# EAGLE design wm8731_breakout (EAGLE 6.2)
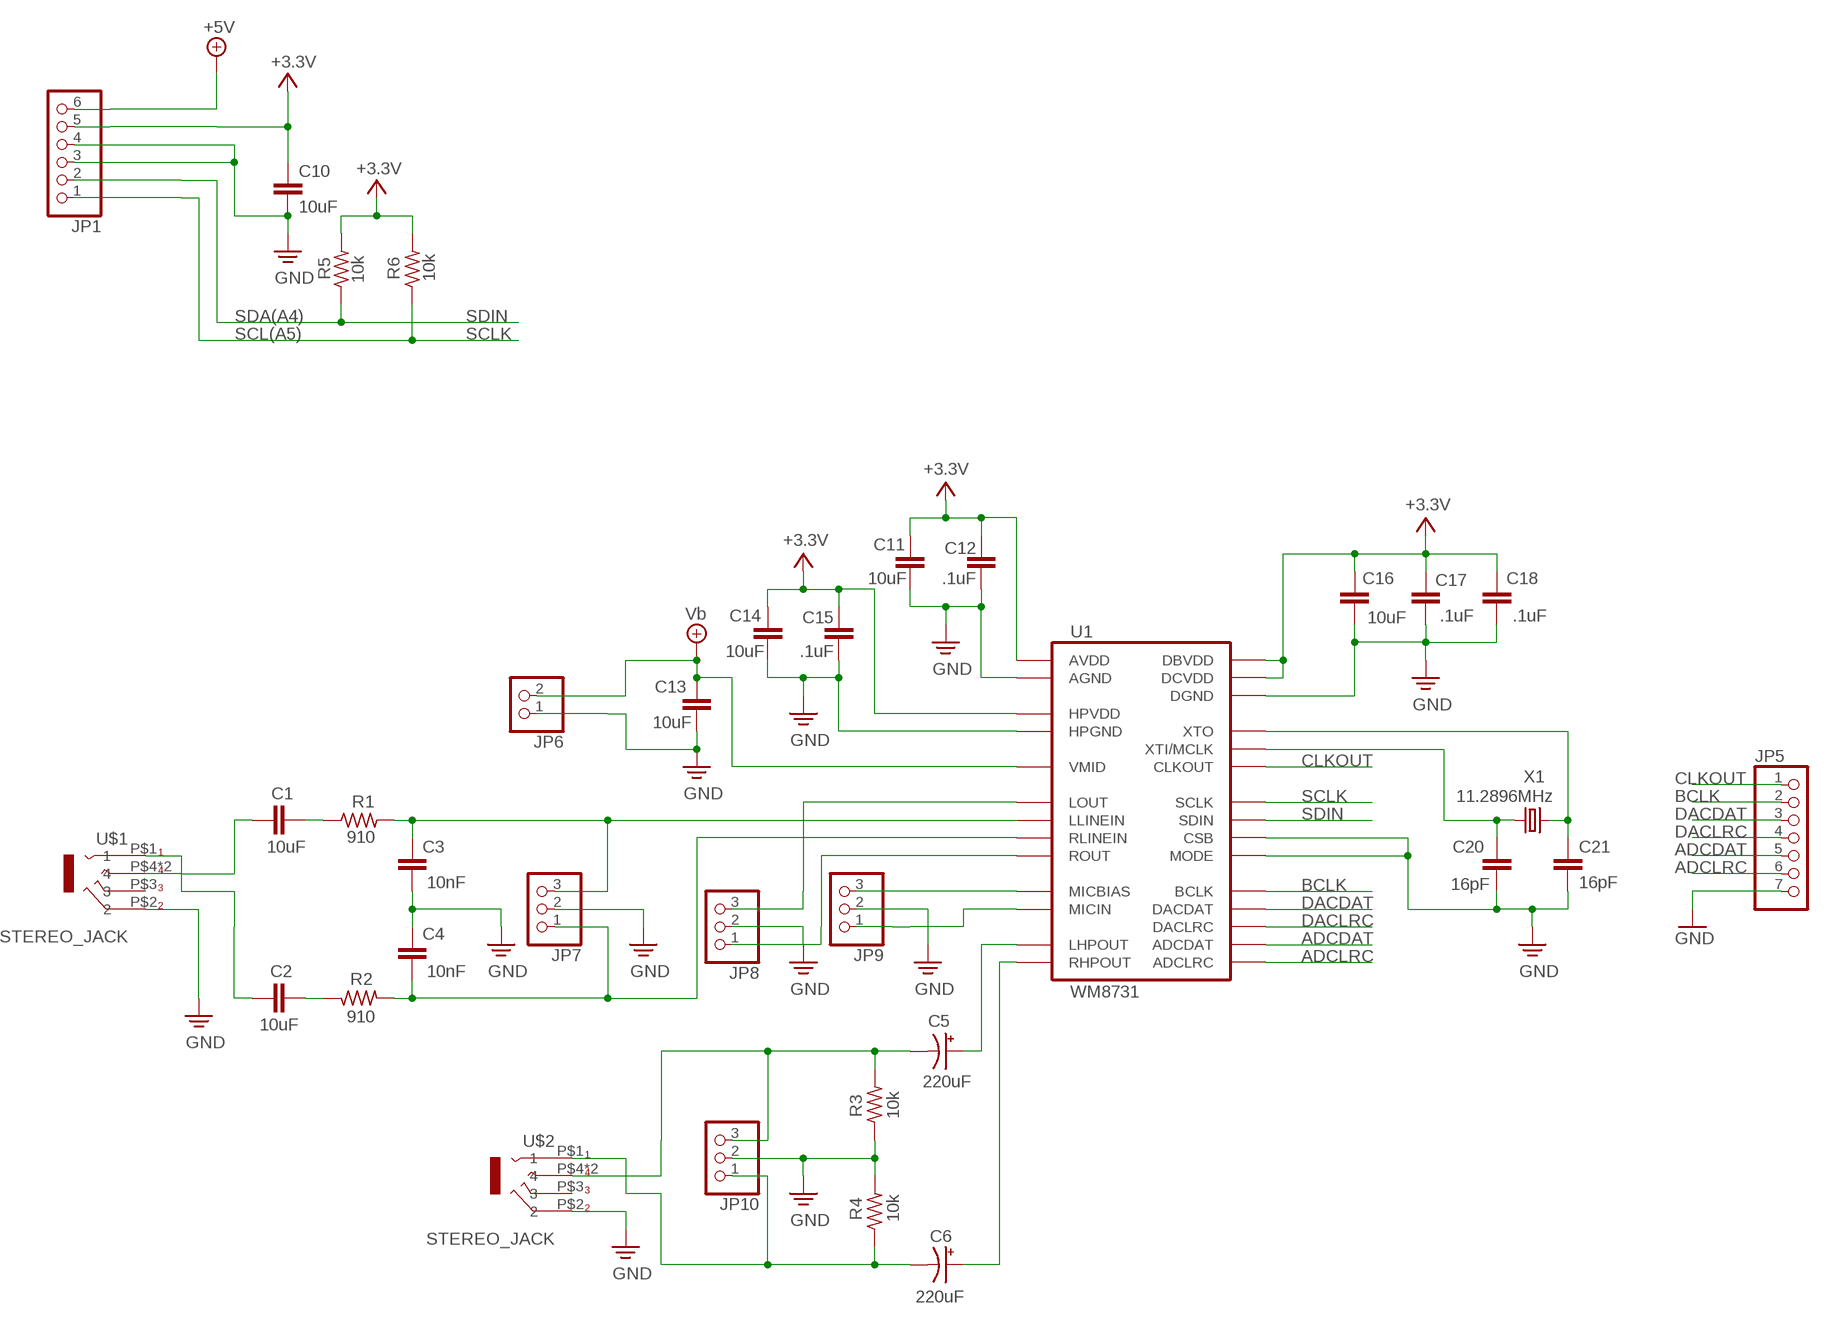
[diagram p0: schematic, sheet 1]

## Parts
C1  10uF  CAPACITOR0805  [0805A]
C2  10uF  CAPACITOR0805  [0805A]
C3  10nF  CAPACITOR0805  [0805A]
C4  10nF  CAPACITOR0805  [0805A]
C5  220uF  CAPACITOR-POL6.3MMX2.5MM  [CAP/6.3MMX2.5MM]
C6  220uF  CAPACITOR-POL6.3MMX2.5MM  [CAP/6.3MMX2.5MM]
C10  10uF  CAPACITOR0805  [0805A]
C11  10uF  CAPACITOR0805  [0805A]
C12  .1uF  CAPACITOR0805  [0805A]
C13  10uF  CAPACITOR0805  [0805A]
C14  10uF  CAPACITOR0805  [0805A]
C15  .1uF  CAPACITOR0805  [0805A]
C16  10uF  CAPACITOR0805  [0805A]
C17  .1uF  CAPACITOR0805  [0805A]
C18  .1uF  CAPACITOR0805  [0805A]
C20  16pF  CAPACITOR0805  [0805A]
C21  16pF  CAPACITOR0805  [0805A]
JP1  PINHD-1X6  [1X06]
JP5  PINHD-1X7  [1X07]
JP6  PINHD-1X2  [1X02]
JP7  PINHD-1X3  [1X03]
JP8  PINHD-1X3  [1X03]
JP9  PINHD-1X3  [1X03]
JP10  PINHD-1X3  [1X03]
R1  910  RESISTOR0805  [0805A]
R2  910  RESISTOR0805  [0805A]
R3  10k  RESISTOR0805  [0805A]
R4  10k  RESISTOR0805  [0805A]
R5  10k  RESISTOR0805  [0805A]
R6  10k  RESISTOR0805  [0805A]
U1  WM8731  [28-SSOP]
U$1  STEREO_JACK  [JACK_STEREO]
U$2  STEREO_JACK  [JACK_STEREO]
X1  11.2896MHz  CRYSTALHC49U/SMT  [HC49U/SMT]

## Nets
+5V: JP1.6
+5V/1: C13.- JP6.2 U1.P$16(VMID) ; supply symbol labelled Vb
ADCDAT: JP5.5 U1.P$6(ADCDAT)
ADCLRC: JP5.6 U1.P$7(ADCLRC)
BCLK: JP5.2 U1.P$3(BCLK)
CLKOUT: JP5.1 U1.P$2(CLKOUT)
DACDAT: JP5.3 U1.P$4(DACDAT)
DACLRC: JP5.4 U1.P$5(DACLRC)
GND: JP5.7
LINE_IN: C1.+ U$1.P$4 U$1.P$5
N$1: C5.P$1(+) U1.P$9(LHPOUT)
N$2: C6.P$1(+) U1.P$10(RHPOUT)
N$3: JP9.1 U1.P$18(MICIN)
N$4: C1.- R1.+
N$5: C5.P$2(-) JP10.3 R3.- U$2.P$4 U$2.P$5
N$6: C6.P$2(-) JP10.1 R4.+ U$2.P$1
N$7: JP8.3 U1.P$12(LOUT)
N$9: JP8.1 U1.P$13(ROUT)
N$10: C3.- JP7.3 R1.- U1.P$20(LLINEIN)
N$16: C2.- U$1.P$1
N$17: C2.+ R2.+
N$23: C4.- JP7.1 R2.- U1.P$19(RLINEIN)
N$35: JP9.3 U1.P$17(MICBIAS)
N$57: C20.+ U1.P$25(XTI/MCLK) X1.1
N$58: C21.+ U1.P$26(XTO) X1.2
PE: C3.+ C4.+ C10.- C11.+ C12.+ C13.+ C14.+ C15.+ C16.+ C17.+ C18.+ C20.- C21.- JP1.3 JP1.4 JP6.1 JP7.2 JP8.2 JP9.2 JP10.2 R3.+ R4.- U1.P$11(HPGND) U1.P$15(AGND) U1.P$21(MODE) U1.P$22(CSB) U1.P$28(DGND) U$1.P$2 U$2.P$2 ; supply symbol labelled GND
SCLK: JP1.1 R6.+ U1.P$24(SCLK)
SDIN: JP1.2 R5.+ U1.P$23(SDIN)
VCC: C10.+ C11.- C12.- C14.- C15.- C16.- C17.- C18.- JP1.5 R5.- R6.- U1.P$1(DBVDD) U1.P$8(HPVDD) U1.P$14(AVDD) U1.P$27(DCVDD) ; supply symbol labelled +3.3V
Unconnected: U$1.P$3 U$2.P$3

## Notes on the sheet
- SDA(A4)
- SCL(A5)

## Library data of the parts
C1-C4 C10-C18 C20 C21 = audioint:CAPACITOR
C5 C6 = audioint:CAPACITOR-POL
JP1 = pinhead:PINHD-1X6: PIN HEADER
JP5 = pinhead:PINHD-1X7: PIN HEADER
JP6 = pinhead:PINHD-1X2: PIN HEADER
JP7-JP10 = pinhead:PINHD-1X3: PIN HEADER
R1-R6 = audioint:RESISTOR
U1 = audioint:WM8731
U$1 U$2 = stero jack:STEREO_JACK
X1 = audioint:CRYSTAL

## Net classes
0 default: width 0.203 mm

## Board
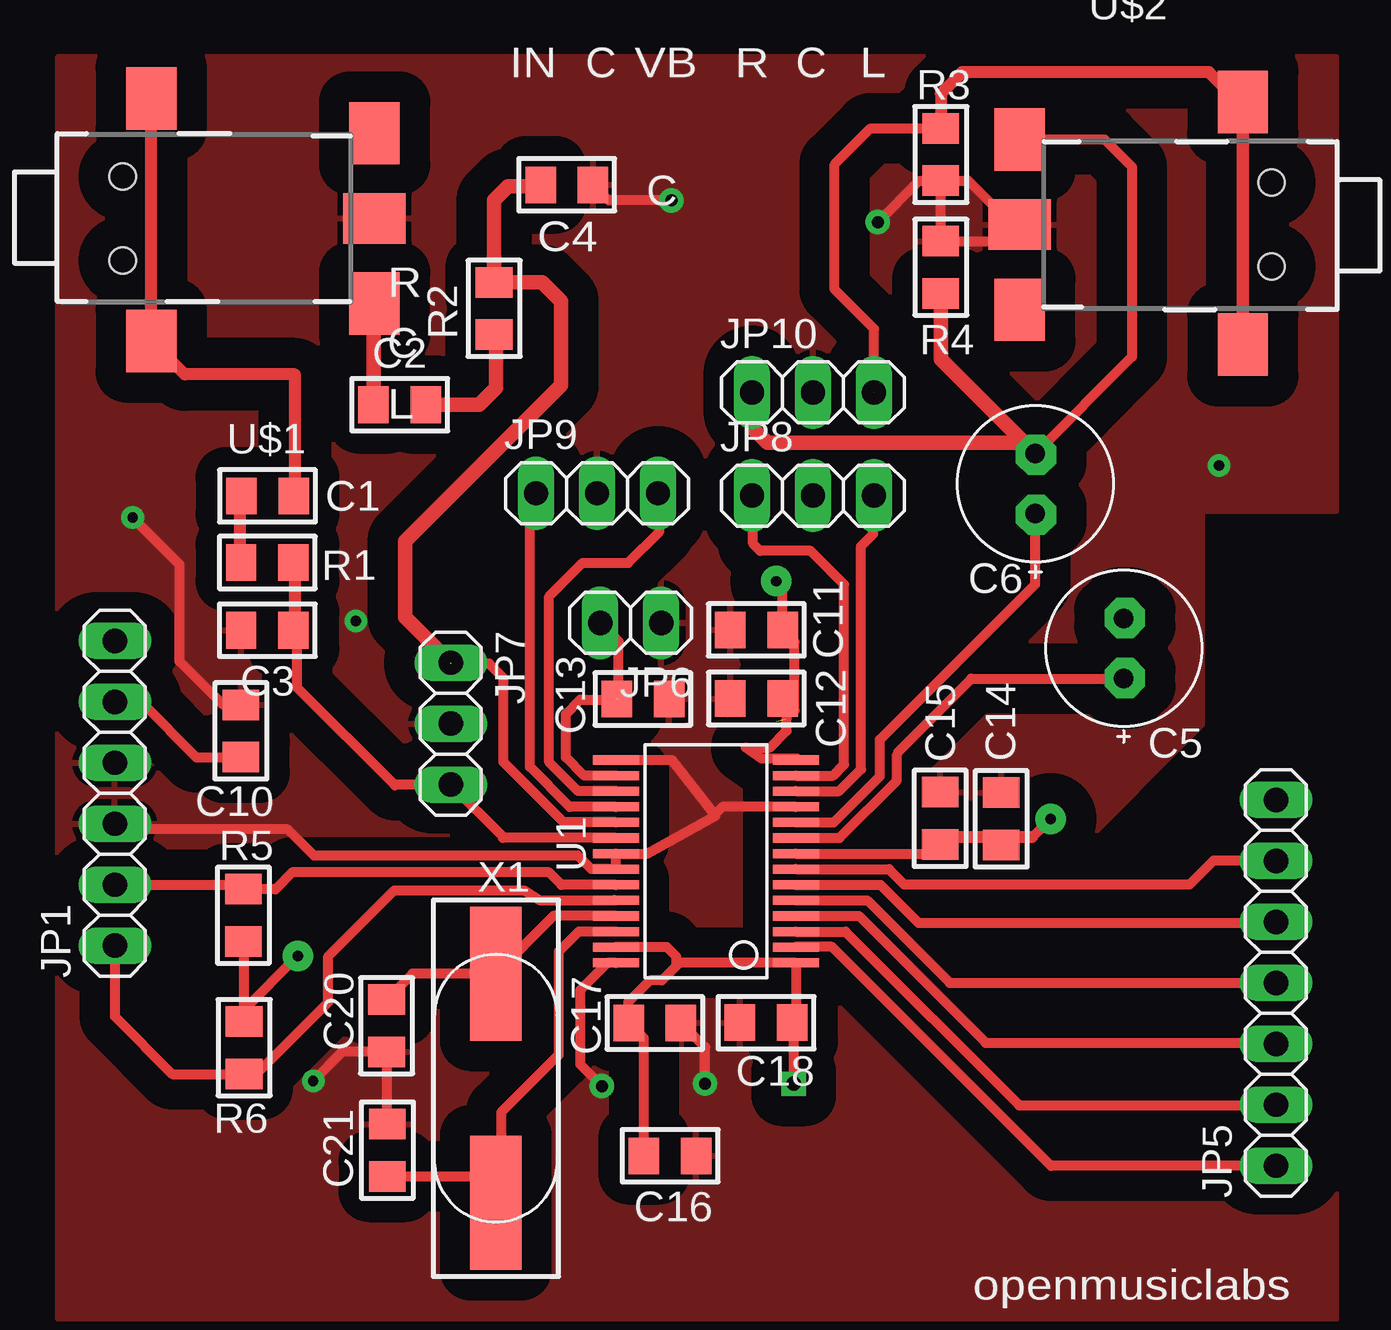
[diagram p1: board, top side]
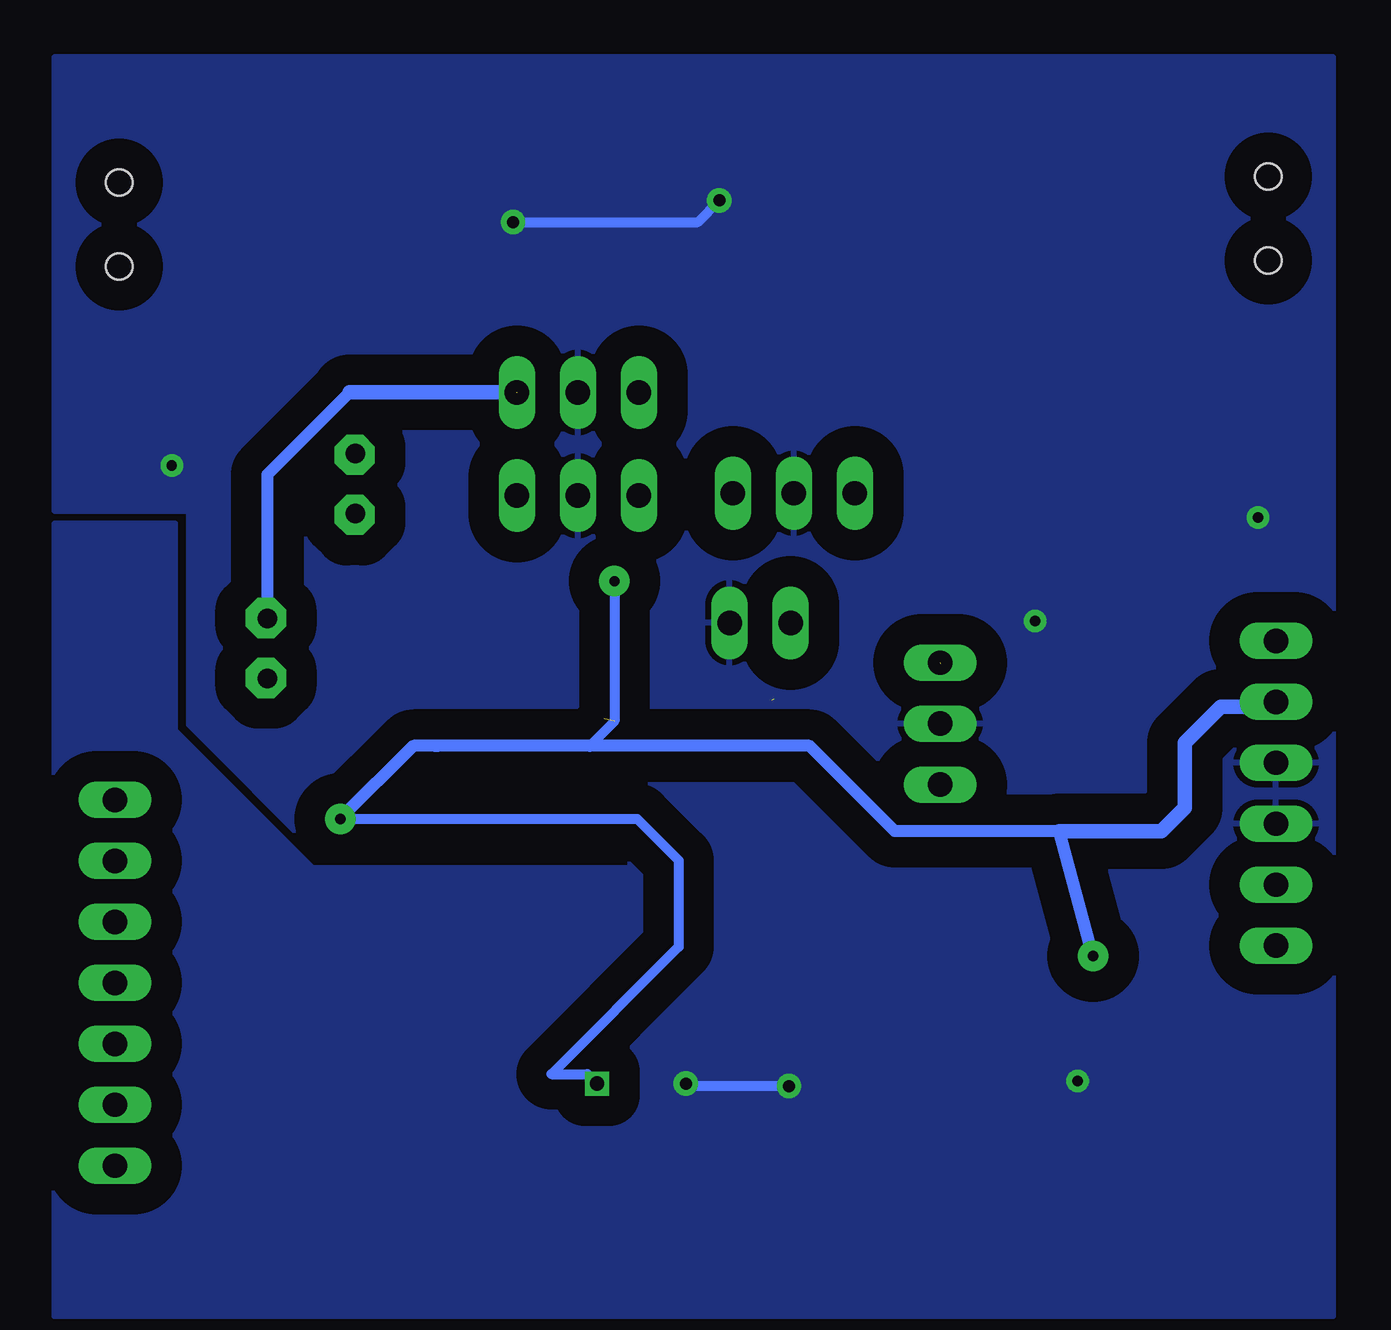
[diagram p2: board, bottom side, seen from below]

No outline drawn. Coordinates in mm, seen from the top.
Copper layers (1*16): Top 0.035mm / dielectric 1.5mm / Bottom 0.035mm
Design rules: minimum track width 8mil, minimum drill 15mil, track to track 8mil, track to pad 8mil, pad to pad 8mil, via to via 8mil, smd to smd 8mil, copper to edge 8mil, drill to drill 8mil, minimum pad ring 10mil, minimum via ring 8mil, stop-mask expansion 4mil, vias tented up to drill 0mil, thermal gap 10mil

### Footprints (pad centres in the part's own frame; a part is rotated, then mirrored left to right if it is on the bottom)
0805A = smd 1.27 x 1.524: + 1.091,0; - -1.091,0
CAP/6.3MMX2.5MM = drill 0.813 pad 1.321: P$1 1.25,0; P$2 -1.25,0
1X06 = drill 1.016 long: 1 -6.35,0; 2 -3.81,0; 3 -1.27,0; 4 1.27,0; 5 3.81,0; 6 6.35,0
1X07 = drill 1.016 long: 1 -7.62,0; 2 -5.08,0; 3 -2.54,0; 4 0,0; 5 2.54,0; 6 5.08,0; 7 7.62,0
1X02 = drill 1.016 long: 1 -1.27,0; 2 1.27,0
1X03 = drill 1.016 long: 1 -2.54,0; 2 0,0; 3 2.54,0
28-SSOP = smd 0.381 x 1.905: P$1 -4.55,-3.752; P$2 -3.9,-3.752; P$3 -3.25,-3.752; P$4 -2.6,-3.752; P$5 -1.95,-3.752; P$6 -1.3,-3.752; P$7 -0.65,-3.752; P$8 0,-3.752; P$9 0.65,-3.752; P$10 1.3,-3.752; P$11 1.95,-3.752; P$12 2.6,-3.752; P$13 3.25,-3.752; P$14 3.9,-3.752; P$15 3.9,3.752; P$16 3.25,3.752; P$17 2.6,3.752; P$18 1.95,3.752; P$19 1.3,3.752; P$20 0.65,3.752; P$21 0,3.752; P$22 -0.65,3.752; P$23 -1.3,3.752; P$24 -1.95,3.752; P$25 -2.6,3.752; P$26 -3.25,3.752; P$27 -3.9,3.752; P$28 -4.55,3.752
JACK_STEREO = smd 2.6 x 2.1: P$1 -3.55,-7; P$3 3.55,-7; P$4 -5.1,2.3; P$5 5,2.3 | smd 2.1 x 2.6: P$2 0,-7 | hole 1.1: -1.75,3.5; 1.75,3.5
HC49U/SMT = smd 5.588 x 2.134: 1 -4.774,0; 2 4.774,0

### Placement (x,y rotation side)
C1  8.96,34.39 0 top
C2  14.48,38.19 0 top
C3  8.96,28.79 180 top
C4  21.44,47.35 0 top
C5  44.65,28.04 270 top
C6  40.97,34.9 270 top
C10  7.86,24.6 270 top
C11  29.34,28.81 180 top
C12  29.34,25.95 180 top
C13  24.61,25.93 0 top
C14  39.54,20.93 90 top
C15  37,20.96 90 top
C16  25.74,6.89 0 top
C17  25.11,12.43 0 top
C18  29.75,12.44 180 top
C20  13.93,12.31 90 top
C21  13.96,7.13 270 top
JP1  2.6,22 90 top
JP5  51,14.1 90 top
JP6  24.1,29.1 180 top
JP7  16.6,24.9 270 top
JP8  31.7,34.4 0 top
JP9  22.7,34.5 0 top
JP10  31.7,38.7 0 top
R1  8.96,31.61 180 top
R2  18.41,42.2 270 top
R3  37.03,48.62 270 top
R4  37.03,43.92 270 top
R5  7.96,16.92 90 top
R6  7.99,11.4 270 top
U1  27.24,19.49 90 top
U$1  6.42,45.95 90 top
U$2  47.32,45.7 270 top
X1  18.48,9.71 270 top

### Tracks (layer width: path | path; a pad name or v marks a point on that pad's centre or on a via)
+5V/1  (1 unrouted)
  Top 0.254: C13.- 23.49,25.93
  Top 0.406: U1.P$16 22.16,22.74 21.4,23.5 21.4,25.3 22,25.9 23.6,25.9 23.6,28.26 23.6,28.33 JP6.2
ADCDAT
  Top 0.406: U1.P$6 34.51,18.19 36.1,16.6 50.96,16.6 JP5.5
ADCLRC
  Top 0.254: 30.93,18.9 U1.P$7
  Top 0.406: U1.P$7 34.88,18.84 34.88,18.82 35.5,18.2 47.4,18.2 48.4,19.2 50.98,19.2 JP5.6
BCLK
  Top 0.406: U1.P$3 33.06,16.24 40.3,9 50.98,9 JP5.2
CLKOUT
  Top 0.406: JP5.1 41.62,6.48 32.5,15.6 31,15.6 U1.P$2
DACDAT
  Top 0.406: U1.P$4 33.61,16.89 38.9,11.6 50.96,11.6 JP5.3
DACLRC
  Top 0.406: U1.P$5 33.96,17.54 37.4,14.1 JP5.4
LINE_IN
  Top 0.508: 10.11,34.34 10.11,34.27 | C1.+ 10.11,34.34 | 10.11,34.34 10.11,39.45 5.52,39.45 U$1.P$4 U$1.P$5
N$1
  Top 0.406: U1.P$9 32.81,20.14 35.2,22.52 35.2,23.57 35.25,23.72 38.3,26.77 44.65,26.77
  Top 0.508: 44.65,26.77 C5.P$1
N$2
  Top 0.406: U1.P$10 32.57,20.79 34.49,22.71 34.49,24.23 35,24.74 | 35,24.74 34.74,24.49 | 35,24.74 40.97,30.71 C6.P$1
N$3
  Top 0.406: U1.P$18 21.56,21.44 19.9,23.1 19.9,34.03 19.9,34.24 JP9.1
N$4
  Top 0.508: 7.82,31.57 7.82,31.47 | R1.+ 7.82,31.57 | C1.- 7.82,34.34 7.82,31.57
N$5  (1 unrouted)
  Top 0.406: JP10.3 34.25,41.35 32.6,43 32.6,48.2 34.1,49.7 R3.-
  Top 0.508: U$2.P$4 U$2.P$5 49.62,50.63 48.21,52.05 37.92,52.05 37.03,51.16 R3.-
  Bottom 0.508: C5.P$2 44.65,35.28 41.22,38.71
  Bottom 0.61: JP10.3 41.21,38.7 41.22,38.71
N$6
  Top 0.406: U$2.P$1 43.85,49.24 45,48.1 45,40.18 C6.P$2
  Top 0.61: R4.+ 37.03,40.09 C6.P$2 40.52,36.6 29.8,36.6 29.16,37.24 JP10.1
  Bottom 0.508: C6.P$2 40.97,36.17
N$7
  Top 0.406: U1.P$12 32.79,22.09 33.7,23 33.7,32.3 34.2,32.8 34.2,34.36 JP8.3
N$9
  Top 0.406: U1.P$13 32.54,22.74 33,23.2 33,30.7 31.6,32.1 29.5,32.1 29.2,32.4 29.2,34.36 JP8.1
N$10
  Top 0.406: U1.P$20 18.77,20.14 18.77,20.19 JP7.3 14.31,22.36 14.27,22.33 10.2,26.4 10.2,28.64 C3.-
  Top 0.508: 10.11,28.73 10.11,28.68 | C3.- 10.11,28.73 | R1.- 10.11,31.55 10.11,28.73
N$12  (via drill 0.5 pad 1.68)
  other vias: 41,33.6
N$13  (via drill 0.5 pad 1.68)
  other vias: 41,36.1
N$16
  Top 0.61: C2.- 13.38,42.36 U$1.P$1
N$17
  Top 0.61: C2.+ 17.79,38.19 18.5,38.9 18.5,41.02 R2.+
N$18  (via drill 0.5 pad 1.68)
  other vias: 44.7,29.3
N$21  (via drill 0.5 pad 1.68)
  other vias: 44.7,26.8
N$23  (1 unrouted)
  Top 0.406: U1.P$19 21.31,20.79 18.8,23.3 18.8,26.8 18.2,27.4 16.59,27.4 | JP7.1 16.55,27.44 14.68,29.31
  Top 0.61: C4.- 20.29,47.3 19,47.3 18.41,46.71 R2.- 20.41,43.29 21.2,42.5 21.2,39 14.7,32.5 14.7,29.34 JP7.1
N$35
  Top 0.406: U1.P$17 21.91,22.09 20.7,23.3 20.7,30.2 22.1,31.6 24,31.6 25.3,32.9 25.3,34.35 25.3,34.44 JP9.3
N$57
  Top 0.406: U1.P$25 20.89,16.89 X1.1 15.01,14.49 C20.+
N$58
  Top 0.254: 18.23,4.93 18.24,4.94 X1.2 18.73,4.94 | 18.73,4.94 18.74,4.93 | 17.63,6.04 17.84,5.83 18.73,4.94
  Top 0.406: U1.P$26 21.94,16.24 21.1,15.4 21.1,11.1 18.7,8.7 18.7,6.7 17.84,5.83 | C21.+ 17.63,6.04
PE  (via drill 0.43 pad 0.94, 0.5 pad 1.02)
  Top 0.406: U1.P$15 25.81,23.39 27.6,21.1 | 27.6,21.1 27.63,21.06 24.79,19.49 U1.P$21 U1.P$22 22.46,18.84 21.9,19.4 15.5,19.4 10.9,19.4 9.8,20.5 2.83,20.5 JP1.3 | U1.P$11 27.94,21.44 27.6,21.1 | v10.87,10.01 12.08,11.22 C20.- 13.93,8.25 C21.- | U1.P$28 23.14,14.94 22,13.8 22,10.7 v22.9,9.8 | v27.2,9.9 27.2,11.43 C17.+ | R3.+ 38.17,47.52 39.6,46.1 39.91,46.1 U$2.P$2 39.63,45.01 R4.- 37.03,47.23 37.3,47.5 36.1,47.5 v34.4,45.8 | v25.8,46.7 23.18,46.7 C4.+ | C10.- 7.87,25.7 7.1,25.7 5.3,27.5 5.3,31.53 v3.35,33.48
  Bottom 0.406: v22.9,9.8 27.1,9.8 v27.2,9.9 | v34.4,45.8 26.7,45.8 v25.8,46.7
  other vias: 48.63,35.65 12.65,29.18
  pour Top (isolate 1.27): 47.95,33.76 53.54,33.76 53.54,52.68 0.2,52.68 0.2,0.1 53.54,0.1 53.54,33.25 48.46,33.25 48.46,24.61 42.74,18.9 29.54,18.9 29.54,19.41 42.49,19.41 47.95,24.87
  pour Bottom (isolate 1.27): 0.2,52.68 53.54,52.68 53.54,33.76 47.95,33.76 47.95,24.87 42.49,19.41 29.54,19.41 29.54,18.9 42.74,18.9 48.46,24.61 48.46,33.25 53.54,33.25 53.54,0.2 0.2,0.2
SCLK
  Top 0.406: U1.P$24 23.42,17.55 20.3,17.55 19.65,17.95 14.25,17.95 11.5,15.2 11.5,13.3 8.51,10.31 R6.+ 5,10.3 2.6,12.7 JP1.1
SDIN
  Top 0.406: U1.P$23 21.21,18.19 20.7,18.7 10,18.7 9.3,18 R5.+ 7.78,18.19 JP1.2
VCC  (via drill 0.43 pad 1.27, 0.6)  (1 unrouted)
  Top 0.254: C15.- 37,19.69 37.03,19.66 36.86,19.49 | 23.31,15.6 23.48,15.6 U1.P$27 | C18.- 30.93,12.54 30.93,12.55 | 30.93,14.88 U1.P$1 | 24.08,12.29 23.82,12.29 | 31.03,23.44 30.95,23.34 U1.P$14 | C12.- 30.93,25.45
  Top 0.406: 31.03,23.44 29.56,23.44 28.9,23.9 29.9,23.9 30.6,24.6 30.6,25.11 | 23.48,15.6 25.6,15.6 26,15.2 26,14.8 | 26,14.8 25.4,14.2 24.9,14.2 24,13.3 24,12.45 C17.- 24.65,11.79 C16.- | U1.P$8 36.62,19.49 C15.- | 26,14.8 26.14,14.94 U1.P$1 30.99,12.6 C18.- 30.9,12.38 v30.9,9.9 | JP1.5 3.69,25.81 6,23.5 C10.+ | R5.- 7.99,15.79 R6.- 7.99,12.98 v10.23,15.22 | v30.17,30.84 30.43,30.57 C11.- 30.93,28.31 30.93,25.45 | 40.84,20.17 v41.6,20.93
  Top 0.508: 24.08,12.49 24.08,12.55 | 24.08,12.49 C17.- | 24.08,12.29 24.08,12.49 | C14.- 39.54,19.81 39.57,19.79 39.44,19.66 39.57,19.66 | C12.- 30.43,26 30.43,26.01 30.43,26.02 | 39.57,19.66 39.7,19.66 | C11.- | C11.- 30.43,28.68 | 39.57,19.66 39.57,20.17 39.51,20.11 | C15.- 37.03,19.89 37.03,20.17 39.06,20.17 39.32,19.91 | 39.32,19.91 39.57,19.66 | 39.51,20.11 39.32,19.91 | 39.51,20.11 39.44,20.17 40.84,20.17
  Bottom 0.406: v30.17,30.84 30.17,25.01 31.2,23.98 | v41.6,20.93 29.23,20.93 27.5,19.2 27.5,15.6 32.8,10.3 31.3,10.3 v30.9,9.9
  Bottom 0.508: 37.54,23.98 31.2,23.98 22.04,23.98 18.49,20.42 11.63,20.42 v10.23,15.22 | 37.54,23.98 37.66,23.98 | v41.6,20.93 38.55,23.98 37.54,23.98
  Bottom 0.61: 11.63,20.42 7.38,20.42 6.4,21.4 6.4,24.1 4.9,25.6 2.81,25.6 JP1.5

### Text on the board
tNames: audio | codec | shield | IN | C | VB | R | C | L | C | R | C | L | openmusiclabs